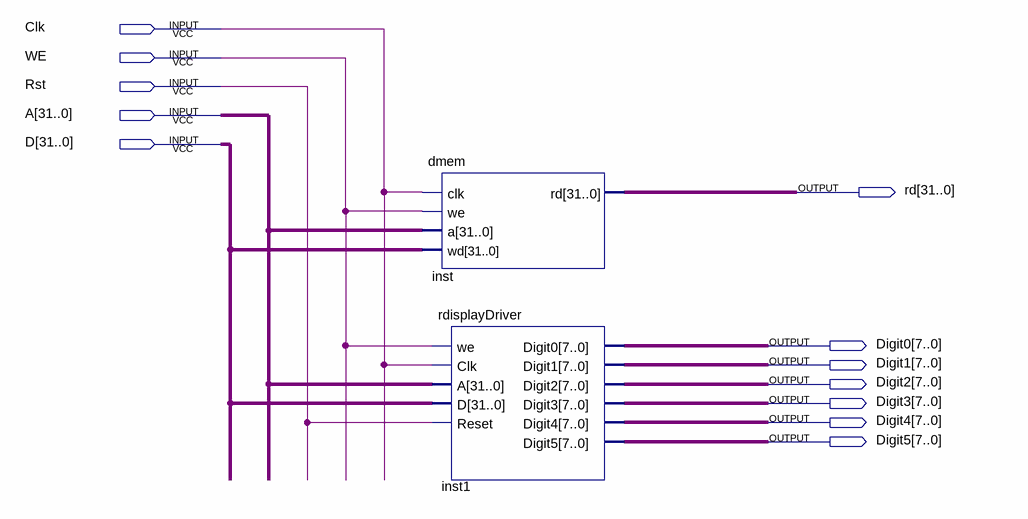
[diagram p0: schematic sheet]
// Quartus schematic ram.bdf as structural Verilog: 2 symbols, 12 pins
module ram (
  input  Clk,
  input  WE,
  input  Rst,
  input  [31:0] A,
  input  [31:0] D,
  output [31:0] rd,
  output [7:0] Digit0,
  output [7:0] Digit1,
  output [7:0] Digit2,
  output [7:0] Digit3,
  output [7:0] Digit4,
  output [7:0] Digit5
);

  dmem inst (.clk(Clk), .we(WE), .a(A), .wd(D), .rd(rd));
  rdisplayDriver inst1 (
    .we(WE), .Clk(Clk), .A(A), .D(D), .Reset(Rst), .Digit0(Digit0), .Digit1(Digit1), .Digit2(Digit2),
    .Digit3(Digit3), .Digit4(Digit4), .Digit5(Digit5));
endmodule
